# EAGLE design Infrared-String-Bass (EAGLE 5.04)
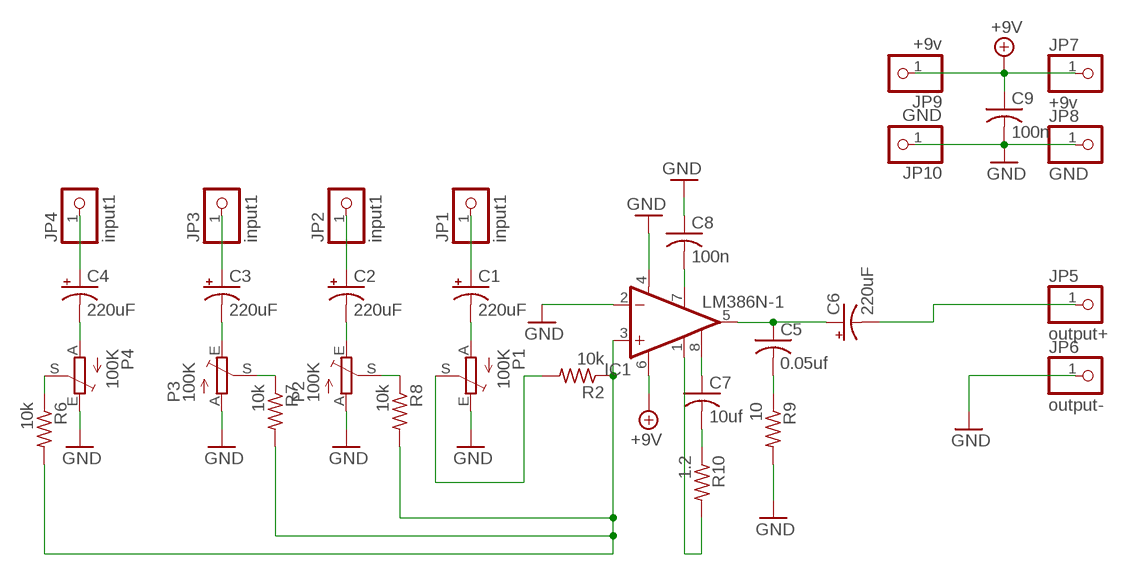
[diagram p0: schematic, sheet 1]

## Parts
C1  220uF  CPOL-USE3.5-8  [E3,5-8]
C2  220uF  CPOL-USE3.5-8  [E3,5-8]
C3  220uF  CPOL-USE3.5-8  [E3,5-8]
C4  220uF  CPOL-USE3.5-8  [E3,5-8]
C5  0.05uf  C-US050-035X075  [C050-035X075]
C6  220uF  CPOL-USE3.5-8  [E3,5-8]
C7  10uf  C-US050-035X075  [C050-035X075]
C8  100n  C-US050-035X075  [C050-035X075]
C9  100n  C-US050-035X075  [C050-035X075]
IC1  LM386N-1  [DIL08]
JP1  input1  PINHD-1X1  [1X01]
JP2  input1  PINHD-1X1  [1X01]
JP3  input1  PINHD-1X1  [1X01]
JP4  input1  PINHD-1X1  [1X01]
JP5  output+  PINHD-1X1  [1X01]
JP6  output-  PINHD-1X1  [1X01]
JP7  +9v  PINHD-1X1  [1X01]
JP8  GND  PINHD-1X1  [1X01]
JP9  +9v  PINHD-1X1  [1X01]
JP10  GND  PINHD-1X1  [1X01]
P1  100K  TRIM_EU-B25V  [B25V]
P2  100K  TRIM_EU-B25V  [B25V]
P3  100K  TRIM_EU-B25V  [B25V]
P4  100K  TRIM_EU-B25V  [B25V]
R2  10k  R-US_0207/10  [0207/10]
R6  10k  R-US_0207/10  [0207/10]
R7  10k  R-US_0207/10  [0207/10]
R8  10k  R-US_0207/10  [0207/10]
R9  10  R-US_0207/10  [0207/10]
R10  1.2  R-US_0207/10  [0207/10]

## Nets
+9V: C9.1 IC1.6(VS) JP7.1 JP9.1
GND: C8.1 C9.2 IC1.2(-IN) IC1.4(GND) JP6.1 JP8.1 JP10.1 P1.E P2.A P3.A P4.E R9.2
N$1: C1.+ JP1.1
N$2: C4.- P4.A
N$3: P4.S R6.1
N$4: IC1.3(+IN) R2.1 R6.2 R7.2 R8.2
N$5: C2.+ JP2.1
N$6: C2.- P2.E
N$7: P2.S R8.1
N$8: C3.+ JP3.1
N$9: C3.- P3.E
N$10: P3.S R7.1
N$11: C4.+ JP4.1
N$12: C1.- P1.A
N$13: P1.S R2.2
N$17: C5.1 C6.+ IC1.5(OUT)
N$18: C5.2 R9.1
N$20: C6.- JP5.1
N$21: C7.1 IC1.8(GAIN)
N$22: IC1.1(GAIN) R10.2
N$23: C7.2 R10.1
N$24: C8.2 IC1.7(BYPASS)

## Library data of the parts
C1-C4 C6 = adafruit:CPOL-US: POLARIZED CAPACITOR, American symbol
C5 C7-C9 = adafruit:C-US: CAPACITOR, American symbol
IC1 = linear:LM386?-*: Low Voltage Audio Power Amplifier Source: http://cache.national.com/ds/LM/LM386.pdf
JP1-JP10 = adafruit:PINHD-1X1: Pin header 1x1 for 0.1" spacing With round pins
P1-P4 = pot:TRIM_EU-: POTENTIOMETER
R2 R6-R10 = adafruit:R-US_: RESISTOR, American symbol

## Board
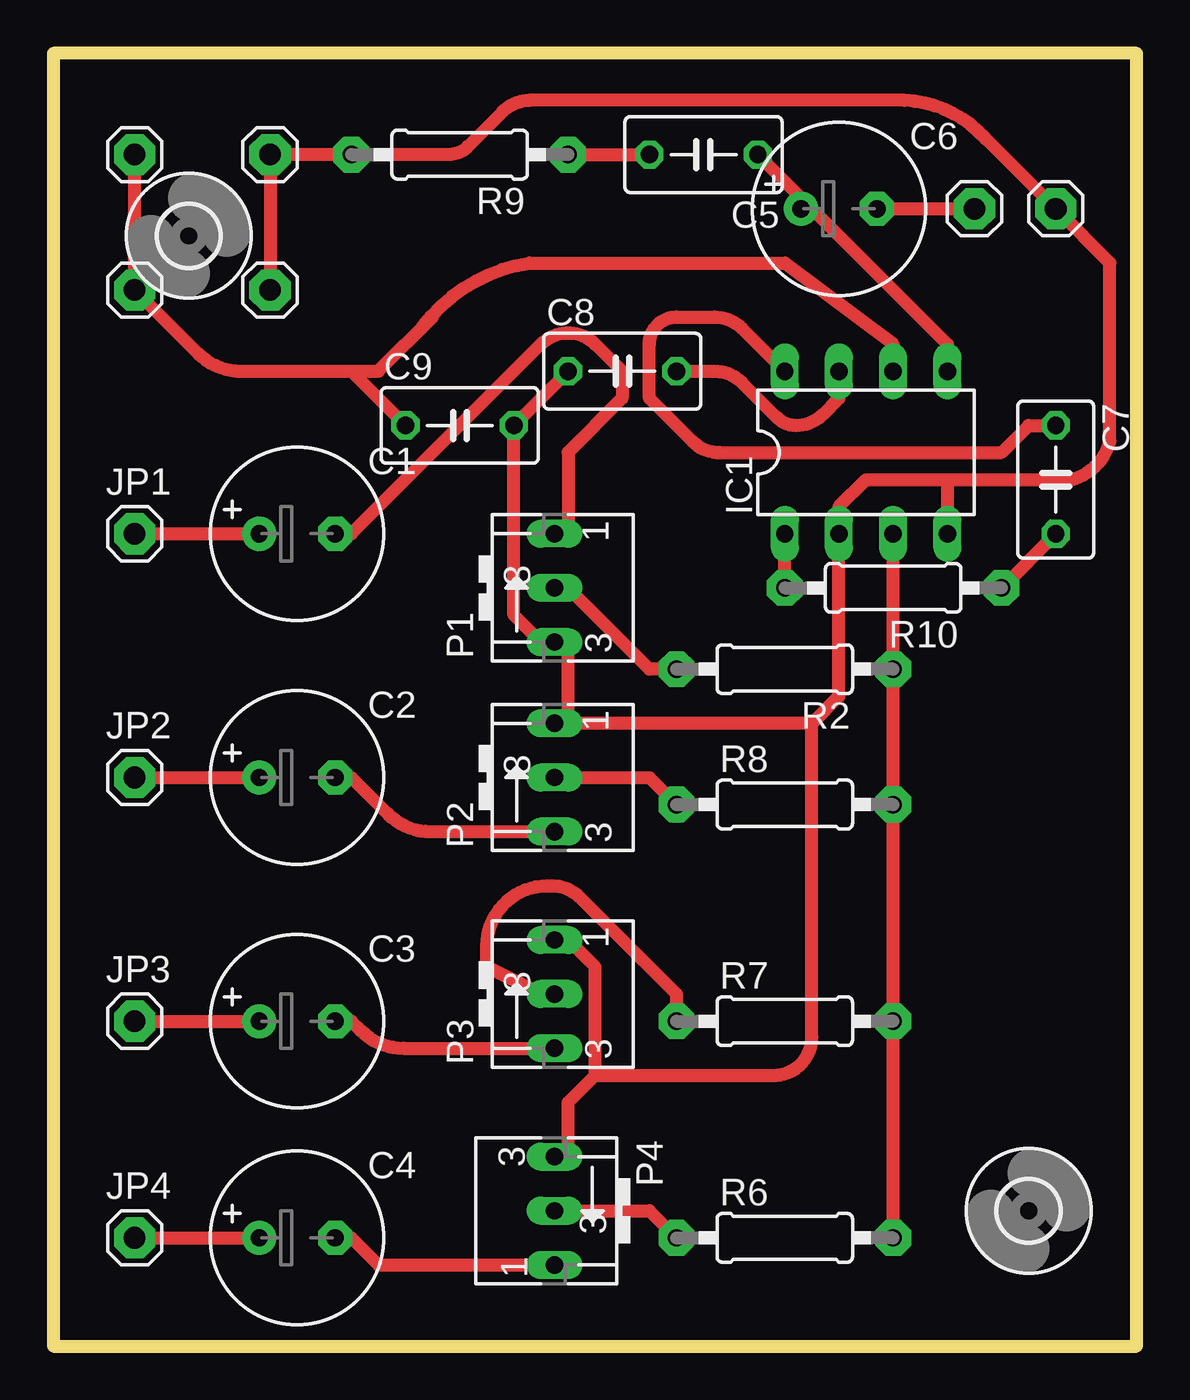
[diagram p1: board, top side]

Size 50.78 x 60.63 mm. Coordinates in mm from the lower left corner, seen from the top.
Outline: 0,0 50.78,0 50.78,60.63 0,60.63 0,0
Copper layers (1*16): Top 0.035mm / dielectric 1.5mm / Bottom 0.035mm
Design rules "default": minimum track width 10mil, minimum drill 24mil, track to track 8mil, track to pad 8mil, pad to pad 8mil, via to via 8mil, smd to smd 8mil, copper to edge 40mil, drill to drill 8mil, minimum pad ring 10mil, minimum via ring 8mil, stop-mask expansion 4mil, vias tented up to drill 0mil, thermal gap 10mil

### Footprints (pad centres in the part's own frame; a part is rotated, then mirrored left to right if it is on the bottom)
E3,5-8 = drill 0.813 pad 1.6 round: + -1.778,0 | drill 0.813 pad 1.6 octagon: - 1.778,0
C050-035X075 = drill 0.813 octagon: 1 -2.54,0; 2 2.54,0
DIL08 = drill 0.813 long: 1 -3.81,-3.81; 2 -1.27,-3.81; 3 1.27,-3.81; 4 3.81,-3.81; 5 3.81,3.81; 6 1.27,3.81; 7 -1.27,3.81; 8 -3.81,3.81
1X01 = drill 1.016 pad 1.93 octagon: 1 0,0
B25V = drill 0.813 long: A 2.54,0.635; E -2.54,0.635; S 0,0.635
0207/10 = drill 0.813 pad 1.676 octagon: 1 -5.08,0; 2 5.08,0
2,8 = hole 2.8: 0,0

### Placement (x,y rotation side)
C1  11.43,38.1 0 top
C2  11.43,26.67 0 top
C3  11.43,15.24 0 top
C4  11.43,5.08 0 top
C5  30.48,55.88 180 top
C6  36.83,53.34 0 top
C7  46.99,40.64 270 top
C8  26.67,45.72 0 top
C9  19.05,43.18 0 top
IC1  38.1,41.91 0 top
JP1  3.81,38.1 0 top
JP2  3.81,26.67 0 top
JP3  3.81,15.24 0 top
JP4  3.81,5.08 0 top
JP5  43.18,53.34 0 top
JP6  46.99,53.34 0 top
JP7  3.81,55.88 0 top
JP8  10.16,49.53 0 top
JP9  3.81,49.53 0 top
JP10  10.16,55.88 0 top
P1  24.13,35.56 90 top
P2  24.13,26.67 90 top
P3  24.13,16.51 90 top
P4  22.86,6.35 270 top
R2  34.29,31.75 180 top
R6  34.29,5.08 0 top
R7  34.29,15.24 0 top
R8  34.29,25.4 0 top
R9  19.05,55.88 180 top
R10  39.37,35.56 180 top
U$1  [2,8]  45.72,6.35 0 top
U$2  [2,8]  6.35,52.07 0 top

### Tracks (layer width: path | path; a pad name or v marks a point on that pad's centre or on a via)
+9V
  Top 0.254: 17.78,48.26 17.72,48.31
  Top 0.61: 17.25,47.73 arc-5 17.72,48.31 arc-40 22.33,50.8 34.29,50.8 39.37,46.99 IC1.6 | JP7.1 JP9.1 6.79,46.55 arc45 8.8,45.72 13.97,45.72 | 17.78,48.26 15.24,45.72 13.97,45.72 | 13.97,45.72 C9.1
GND
  Top 0.254: IC1.2 36.83,39.37 | P4.E 24.13,8.89 | 22.86,33.02 P1.E 24.13,33.02
  Top 0.61: JP8.1 JP10.1 R9.2 18.52,55.88 arc45 19.42,56.25 21.06,57.89 arc-45 22.33,58.42 39.9,58.42 arc-45 43.71,56.62 JP6.1 49.53,50.8 49.53,42.44 arc-90 46.46,40.64 41.91,40.64 | 24.13,8.89 24.13,11.43 25.4,12.7 | 25.4,12.7 25.4,17.78 24.13,19.05 P3.A | C8.1 C9.2 21.59,34.29 22.86,33.02 | 24.13,29.21 24.13,33.02 | 35.56,29.21 36.83,30.48 IC1.2 | 35.56,29.21 24.13,29.21 | 24.13,29.21 P2.A | 41.91,40.64 38.1,40.64 36.83,39.37 | 41.91,40.64 IC1.4 | 25.4,12.7 33.76,12.7 arc90 35.56,14.5 35.56,29.21
N$1
  Top 0.61: JP1.1 C1.+
N$2
  Top 0.254: C4.- 13.97,5.08
  Top 0.61: 13.97,5.08 15.24,3.81 P4.A
N$3
  Top 0.61: R6.1 27.94,6.35 P4.S
N$4
  Top 0.61: R6.2 R7.2 R8.2 R2.1 IC1.3
N$5
  Top 0.61: JP2.1 C2.+
N$6
  Top 0.254: C2.- 13.97,26.67
  Top 0.61: 13.97,26.67 15.68,24.96 arc45 17.69,24.13 P2.E
N$7
  Top 0.61: R8.1 27.94,26.67 P2.S
N$8
  Top 0.61: JP3.1 C3.+
N$9
  Top 0.254: 13.97,15.24 C3.-
  Top 0.61: 13.97,15.24 14.41,14.8 arc45 16.42,13.97 P3.E
N$10
  Top 0.254: P3.S 22.86,16.51
  Top 0.61: 22.86,16.51 20.32,17.78 20.32,18.75 arc-90 23.16,21.59 23.39,21.59 arc-45 24.66,21.06 29.21,16.51 R7.1
N$11
  Top 0.61: JP4.1 C4.+
N$12
  Top 0.254: 24.13,38.1 P1.A | 12.7,38.1 C1.- 13.97,38.1
  Top 0.61: 24.13,38.1 24.13,41.91 26.67,44.45 26.67,45.72 25.4,46.99 arc90 22.86,46.99 13.97,38.1
N$13
  Top 0.254: 24.13,35.56 P1.S
  Top 0.61: 24.13,35.56 27.94,31.75 R2.2
N$17
  Top 0.254: C6.+ 35.56,53.34
  Top 0.61: C5.1 35.56,53.34 41.91,46.99 IC1.5
N$18
  Top 0.61: R9.1 C5.2
N$20
  Top 0.61: C6.- JP5.1
N$21
  Top 0.61: C7.1 45.72,43.18 44.45,41.91 31.22,41.91 arc-45 29.95,42.44 27.94,44.45 27.94,46.99 arc-90 29.21,48.26 31.01,48.26 arc-45 32.28,47.73 IC1.8
N$22
  Top 0.61: R10.2 IC1.1
N$23
  Top 0.61: R10.1 C7.2
N$24
  Top 0.61: C8.2 31.01,45.72 arc-45 32.28,45.19 33.92,43.55 arc45 34.82,43.18 arc45 36.09,43.71 36.83,44.45 IC1.7